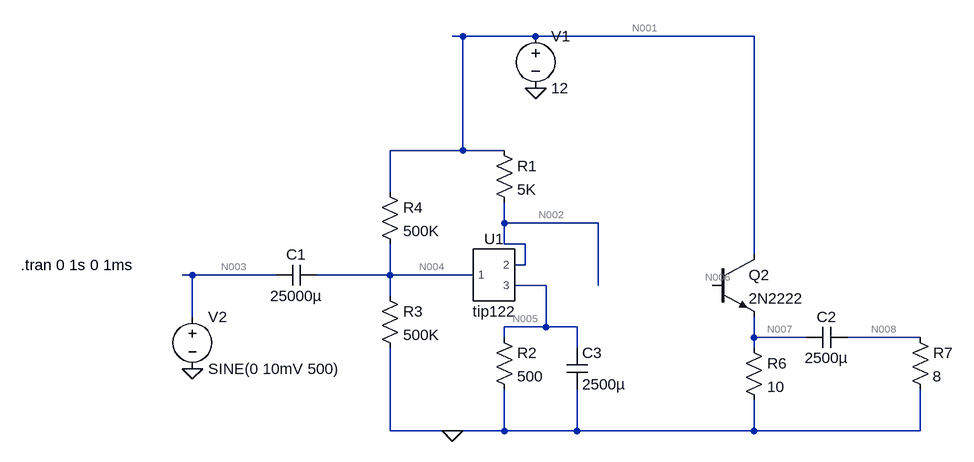
[diagram p0: schematic Common Emitter TIP122 with Common Collector 3.asc]
Common Emitter TIP122 with Common Collector 3.asc, the LTspice schematic file:
Version 4
SHEET 1 920 680
WIRE 160 -256 144 -256
WIRE 272 -256 160 -256
WIRE 608 -256 272 -256
WIRE 160 -80 160 -256
WIRE 160 -80 48 -80
WIRE 224 -80 160 -80
WIRE 48 -16 48 -80
WIRE 224 32 224 0
WIRE 368 32 224 32
WIRE 224 64 224 32
WIRE 256 64 224 64
WIRE 608 80 608 -256
WIRE 256 96 256 64
WIRE 256 96 240 96
WIRE -256 112 -272 112
WIRE -128 112 -256 112
WIRE 48 112 48 64
WIRE 48 112 -64 112
WIRE 176 112 48 112
WIRE 288 128 240 128
WIRE 368 128 368 32
WIRE 560 128 544 128
WIRE 48 144 48 112
WIRE -256 176 -256 112
WIRE 288 192 288 128
WIRE 288 192 224 192
WIRE 336 192 288 192
WIRE 224 208 224 192
WIRE 608 208 608 176
WIRE 688 208 608 208
WIRE 864 208 752 208
WIRE 336 224 336 192
WIRE 608 224 608 208
WIRE 48 352 48 224
WIRE 144 352 48 352
WIRE 224 352 224 288
WIRE 224 352 144 352
WIRE 336 352 336 288
WIRE 336 352 224 352
WIRE 608 352 608 304
WIRE 608 352 336 352
WIRE 864 352 864 288
WIRE 864 352 608 352
FLAG 272 -176 0
FLAG 144 352 0
FLAG -256 256 0
SYMBOL res 208 -96 R0
SYMATTR InstName R1
SYMATTR Value 5K
SYMBOL voltage 272 -272 R0
WINDOW 123 0 0 Left 2
WINDOW 39 0 0 Left 2
SYMATTR InstName V1
SYMATTR Value 12
SYMBOL res 32 -32 R0
SYMATTR InstName R4
SYMATTR Value 500K
SYMBOL res 32 128 R0
SYMATTR InstName R3
SYMATTR Value 500K
SYMBOL res 208 192 R0
SYMATTR InstName R2
SYMATTR Value 500
SYMBOL cap 320 224 R0
SYMATTR InstName C3
SYMATTR Value 2500µ
SYMBOL cap -64 96 R90
WINDOW 0 0 32 VBottom 2
WINDOW 3 32 32 VTop 2
SYMATTR InstName C1
SYMATTR Value 25000µ
SYMBOL voltage -256 160 R0
WINDOW 123 0 0 Left 2
WINDOW 39 0 0 Left 2
SYMATTR InstName V2
SYMATTR Value SINE(0 10mV 500)
SYMBOL npn 544 80 R0
SYMATTR InstName Q2
SYMATTR Value 2N2222
SYMBOL res 592 208 R0
SYMATTR InstName R6
SYMATTR Value 10
SYMBOL res 848 192 R0
WINDOW 3 35 76 Left 2
SYMATTR Value 8
SYMATTR InstName R7
SYMBOL cap 752 192 R90
WINDOW 0 0 32 VBottom 2
WINDOW 3 32 32 VTop 2
SYMATTR InstName C2
SYMATTR Value 2500µ
SYMBOL AutoGenerated\\tip122 208 112 R0
SYMATTR InstName U1
TEXT -520 96 Left 2 !.tran 0 1s 0 1ms

The netlist it stands for:
* Common Emitter TIP122 with Common Collector 3.asc
R1 N001 N002 5K
V1 N001 0 12
R4 N001 N004 500K
R3 N004 0 500K
R2 N005 0 500
C3 N005 0 2500µ
C1 N004 N003 25000µ
V2 N003 0 SINE(0 10mV 500)
Q2 N001 N006 N007 0 2N2222
R6 N007 0 10
R7 N008 0 8
C2 N008 N007 2500µ
XU1 N004 N002 N005 tip122  ; pins 1 2 3
.model NPN NPN
.model PNP PNP
.lib standard.bjt
.tran 0 1s 0 1ms
.lib F:\electronics\LTspiceIV\mycircuits\TIP122.SP3
.backanno
.end

* Results of the author's LTspice run, read from the files saved beside the schematic
* Operating Point, zero values left out:
*   V(n001) = 12 V
*   V(n002) = 2.095 V
*   V(n004) = 1.263 V
*   V(n005) = 999.9 mV
*   V(n006) = 319 mV
*   V(n007) = 25.5 nV
*   Ic(Q2) = 2.55 nA
*   Ie(Q2) = -2.55 nA
*   I(R6) = 2.55 nA
*   I(R2) = 2 mA
*   I(R3) = 2.525 µA
*   I(R4) = 21.47 µA
*   I(R1) = 1.981 mA
*   I(V1) = -2.002 mA
*   Ix(u1:1) = 18.95 µA
*   Ix(u1:2) = 1.981 mA
*   Ix(u1:3) = -2 mA
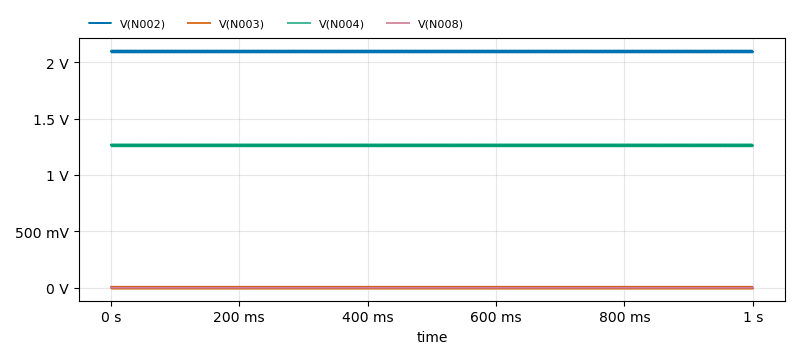
[diagram p1: Transient Analysis of Common Emitter TIP122 with Common Collector 3.asc, plotted from the saved traces]
* Transient Analysis, 1 run:
*   V(N002): min 2.085 V, max 2.105 V, average 2.095 V, rms 2.095 V, last 2.095 V
*   V(N003): min -9.968 mV, max 9.968 mV, average 10.69 nV, rms 7.058 mV, last 0 V
*   V(N004): min 1.252 V, max 1.272 V, average 1.262 V, rms 1.262 V, last 1.262 V
*   V(N008): min -0.05648 fV, max 0.1024 fV, average 0.004262 fV, rms 0.0192 fV, last 0.01666 fV